# Altium schematic sheet PERIPHERALS.SchDoc: PERIPHERALS
size A4; Organization: My Company; Address1: Address Line 1; Address2: Address Line 2; Address3: Address Line 3; Address4: Address Line 4; SheetNumber: 4; SheetTotal: 4; ProjectTitle: Module_Ethernet_W5500
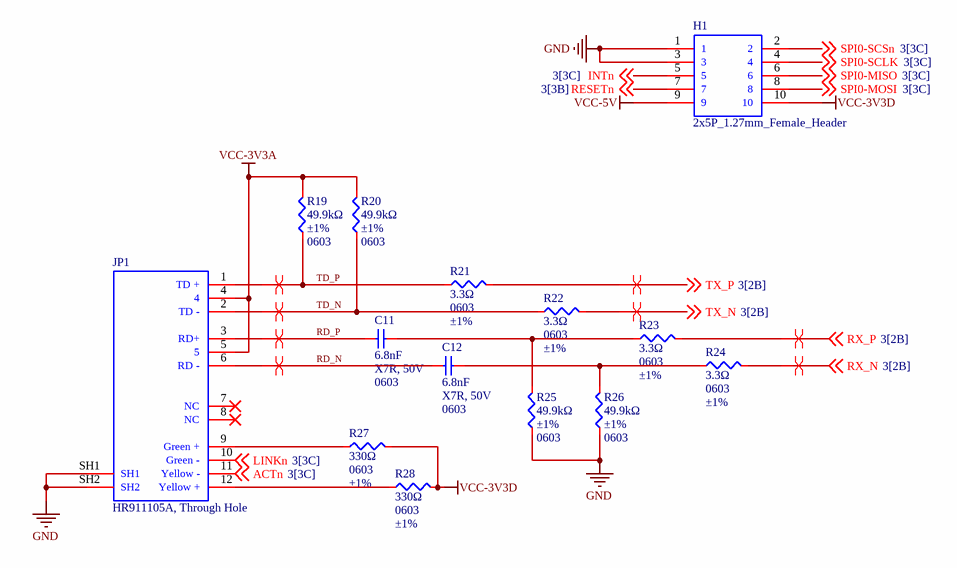
[diagram p0: PERIPHERALS.SchDoc]

## Parts
C11  6.8nF  Temperature Coefficient: X7R, 50V  Package: 0603  [C0603]
C12  6.8nF  Temperature Coefficient: X7R, 50V  Package: 0603  [C0603]
H1  2x5P_1.27mm_Female_Header  [2x5P, 1.27mm, Female Header]
JP1  HR911105A, Through Hole  [HR911105A]
R19  49.9kΩ  Tolerance: ±1%  Package: 0603  [R0603]
R20  49.9kΩ  Tolerance: ±1%  Package: 0603  [R0603]
R21  3.3Ω  Package: 0603  Tolerance: ±1%  [R0603]
R22  3.3Ω  Package: 0603  Tolerance: ±1%  [R0603]
R23  3.3Ω  Package: 0603  Tolerance: ±1%  [R0603]
R24  3.3Ω  Package: 0603  Tolerance: ±1%  [R0603]
R25  49.9kΩ  Tolerance: ±1%  Package: 0603  [R0603]
R26  49.9kΩ  Tolerance: ±1%  Package: 0603  [R0603]
R27  330Ω  Package: 0603  Tolerance: ±1%  [R0603]
R28  330Ω  Package: 0603  Tolerance: ±1%  [R0603]

## Nets
GND: H1.1 H1.3 JP1.SH1 JP1.SH2 R25.1 R26.1
VCC-3V3A: JP1.4 JP1.5 R19.2 R20.2
VCC-3V3D: H1.10 R27.2 R28.2
VCC-5V: H1.9
ACTn: JP1.11(Yellow_-) ; off-sheet ACTn
INTn: H1.5 ; off-sheet INTn
LINKn: JP1.10(Green_-) ; off-sheet LINKn
RD_N: C12.1 JP1.6(RD_-)
RD_P: C11.1 JP1.3(RD+)
RESETn: H1.7 ; off-sheet RESETn
RX_N: R24.2 ; off-sheet RX_N
RX_P: R23.2 ; off-sheet RX_P
SPI0-MISO: H1.6 ; off-sheet SPI0-MISO
SPI0-MOSI: H1.8 ; off-sheet SPI0-MOSI
SPI0-SCLK: H1.4 ; off-sheet SPI0-SCLK
SPI0-SCSn: H1.2 ; off-sheet SPI0-SCSn
TD_N: JP1.2(TD_-) R20.1 R22.1
TD_P: JP1.1(TD_+) R19.1 R21.1
TX_N: R22.2 ; off-sheet TX_N
TX_P: R21.2 ; off-sheet TX_P
NetC11_2: C11.2 R23.1 R25.2
NetC12_2: C12.2 R24.1 R26.2
NetJP1_9: JP1.9(Green_+) R27.1
NetJP1_12: JP1.12(Yellow_+) R28.1

Not connected (* = marked no-connect by the designer): JP1 7(NC)* 8(NC)*

## Layout directives
differential pair: RD_N, RD_P, RX_N, RX_P, TD_N, TD_P, TX_N, TX_P

## Notes on the sheet
- Author:
- Title:
- Size:
- A4
- Project:
- Approved:
- Revision:
- Modified Date:
- CONFIDENTIAL
- Date:
- SW Version:

## Library data of the parts
C11 C12 = C0603_MLCC_6.8nF_X7R_50V: 6.8nF ±10% 50V Ceramic Capacitor X7R 0603; Manufacturer: YAGEO; Mfr. Part: CC0603KRX7R9BB682; LCSC Part: C107097; Capacitance: 6.8nF; Link: https://www.lcsc.com/product-detail/C107097.html; Tolerance: ±10%; Voltage Rating: 50V
H1 = 2x5P_1.27mm_Female_Header: Female Header 10 Position 1.27mm Pitch Dual Row Through Hole -40℃~+105℃; Manufacturer: Megastar; Mfr. Part: ZX-PM1.27-2-5PU; Holes Structure: 2x5P; Key Attributes: CONN SOCKET 10POS 1.27mm DUAL ROW TH; LCSC Part: C7499360; Package: Through Hole,P=1.27mm; Link: https://www.lcsc.com/product-detail/C7499360.html
JP1 = HR911105A: CONN MOD JACK RJ45 TH; Manufacturer: HANRUN(Zhongshan HanRun Elec); Mfr. Part: HR911105A; LCSC Part: C12074; Package: Through Hole; Link: https://www.lcsc.com/product-detail/C12074.html
R19 R20 R25 R26 = R0603_49.9KΩ_±1%: 100mW Thick Film Resistor 75V ±100ppm/℃ ±1% 49.9kΩ 0603 Chip Resistor - Surface Mount ROHS; Manufacturer: YAGEO; Mfr. Part: RC0603FR-0749K9L; LCSC Part: C114624; Resistance: 49.9kΩ; Operating Temperature: -55℃~+155℃; Link: https://www.lcsc.com/product-detail/C114624.html?s_z=n_C114624
R21-R24 = R0603_3.3Ω_±1%: 3.3Ω ±1% 100mW 0603 Thick Film Resistor; Manufacturer: UNI-ROYAL; Mfr. Part: 0603WAF330KT5E; Voltage Rating: 75V; LCSC Part: C22979; Resistance: 3.3Ω; Operating Temperature: -55℃~+155℃; Link: https://www.lcsc.com/product-detail/C22979.html
R27 R28 = R0603_330Ω_±1%: 100mW Thick Film Resistor 75V ±100ppm/℃ ±1% 330Ω 0603 Chip Resistor - Surface Mount ROHS; Manufacturer: YAGEO; Mfr. Part: RC0603FR-07330RL; LCSC Part: C105881; Resistance: 330Ω; Operating Temperature: -55℃~+155℃; Link: https://www.lcsc.com/product-detail/C105881.html